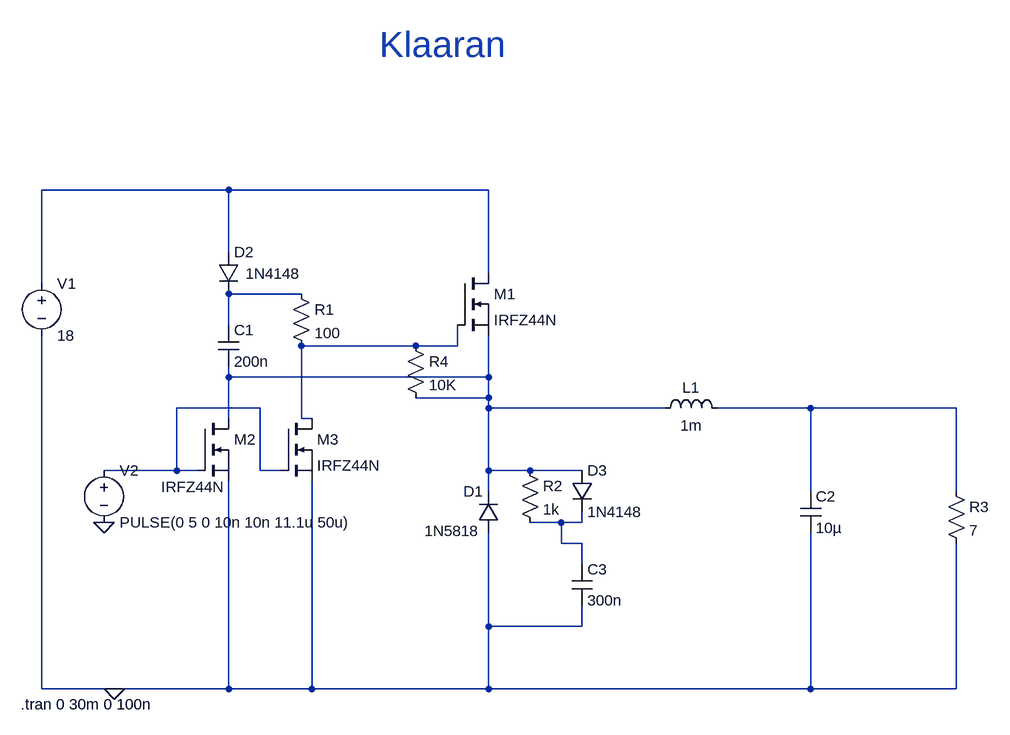
[diagram p0: schematic LED driver_5 PROTOTYPE .asc]
LED driver_5 PROTOTYPE .asc, the LTspice schematic file:
Version 4.1
SHEET 1 2164 760
WIRE 256 -48 -32 -48
WIRE 656 -48 256 -48
WIRE 256 48 256 -48
WIRE 656 80 656 -48
WIRE -32 96 -32 -48
WIRE 368 112 256 112
WIRE 256 160 256 112
WIRE 544 192 368 192
WIRE 608 192 608 160
WIRE 608 192 544 192
WIRE 256 240 256 224
WIRE 656 240 656 176
WIRE 656 240 256 240
WIRE 656 272 656 240
WIRE 656 272 544 272
WIRE 304 288 176 288
WIRE 656 288 656 272
WIRE 928 288 656 288
WIRE 1152 288 1008 288
WIRE 1376 288 1152 288
WIRE 256 304 256 240
WIRE 368 304 368 192
WIRE 384 304 368 304
WIRE 176 384 176 288
WIRE 176 384 64 384
WIRE 208 384 176 384
WIRE 304 384 304 288
WIRE 336 384 304 384
WIRE 656 384 656 288
WIRE 720 384 656 384
WIRE 800 384 720 384
WIRE 656 416 656 384
WIRE 1152 416 1152 288
WIRE 1376 416 1376 288
WIRE 768 464 720 464
WIRE 800 464 800 448
WIRE 800 464 768 464
WIRE 768 496 768 464
WIRE 800 496 768 496
WIRE 800 528 800 496
WIRE 656 624 656 480
WIRE 800 624 800 592
WIRE 800 624 656 624
WIRE -32 720 -32 176
WIRE 80 720 -32 720
WIRE 256 720 256 400
WIRE 256 720 80 720
WIRE 384 720 384 400
WIRE 384 720 256 720
WIRE 656 720 656 624
WIRE 656 720 384 720
WIRE 1152 720 1152 480
WIRE 1152 720 656 720
WIRE 1376 720 1376 496
WIRE 1376 720 1152 720
FLAG 80 720 0
FLAG 64 464 0
SYMBOL voltage -32 80 R0
SYMATTR InstName V1
SYMATTR Value 18
SYMBOL diode 672 480 R180
WINDOW 0 24 64 Left 2
WINDOW 3 30 3 Left 2
SYMATTR InstName D1
SYMATTR Value 1N5818
SYMBOL ind 912 304 R270
WINDOW 0 32 56 VTop 2
WINDOW 3 5 56 VBottom 2
SYMATTR InstName L1
SYMATTR Value 1m
SYMBOL cap 1136 416 R0
SYMATTR InstName C2
SYMATTR Value 10µ
SYMBOL res 1360 400 R0
SYMATTR InstName R3
SYMATTR Value 7
SYMBOL nmos 608 80 R0
SYMATTR InstName M1
SYMATTR Value IRFZ44N
SYMBOL diode 240 48 R0
WINDOW 3 42 33 Left 2
SYMATTR Value 1N4148
SYMATTR InstName D2
SYMBOL cap 240 160 R0
SYMATTR InstName C1
SYMATTR Value 200n
SYMBOL res 352 96 R0
SYMATTR InstName R1
SYMATTR Value 100
SYMBOL nmos 208 304 R0
WINDOW 3 -56 105 Left 2
SYMATTR Value IRFZ44N
SYMATTR InstName M2
SYMBOL nmos 336 304 R0
SYMATTR InstName M3
SYMATTR Value IRFZ44N
SYMBOL voltage 64 368 R0
WINDOW 123 0 0 Left 0
WINDOW 39 0 0 Left 0
SYMATTR InstName V2
SYMATTR Value PULSE(0 5 0 10n 10n 11.1u 50u)
SYMBOL cap 784 528 R0
SYMATTR InstName C3
SYMATTR Value 300n
SYMBOL diode 784 384 R0
SYMATTR InstName D3
SYMATTR Value 1N4148
SYMBOL res 704 368 R0
SYMATTR InstName R2
SYMATTR Value 1k
SYMBOL res 528 176 R0
SYMATTR InstName R4
SYMATTR Value 10K
TEXT -64 744 Left 2 !.tran 0 30m 0 100n
TEXT 488 -272 Left 5 ;Klaaran

The netlist it stands for:
* LED driver_5 PROTOTYPE .asc
V1 N001 0 18
D1 0 N004 1N5818
L1 N004 N006 1m
C2 N006 0 10µ
R3 N006 0 7
M1 N001 N003 N004 N004 IRFZ44N
D2 N001 N002 1N4148
C1 N002 N004 200n
R1 N002 N003 100
M2 N004 N005 0 0 IRFZ44N
M3 N003 N005 0 0 IRFZ44N
V2 N005 0 PULSE(0 5 0 10n 10n 11.1u 50u)
C3 N007 0 300n
D3 N004 N007 1N4148
R2 N004 N007 1k
R4 N003 N004 10K
.model D D
.lib standard.dio
.model NMOS NMOS
.model PMOS PMOS
.lib standard.mos
.tran 0 30m 0 100n
* Klaaran
.backanno
.end